# Altium schematic sheet WiirdFlex Top Alignment.SchDoc
size A
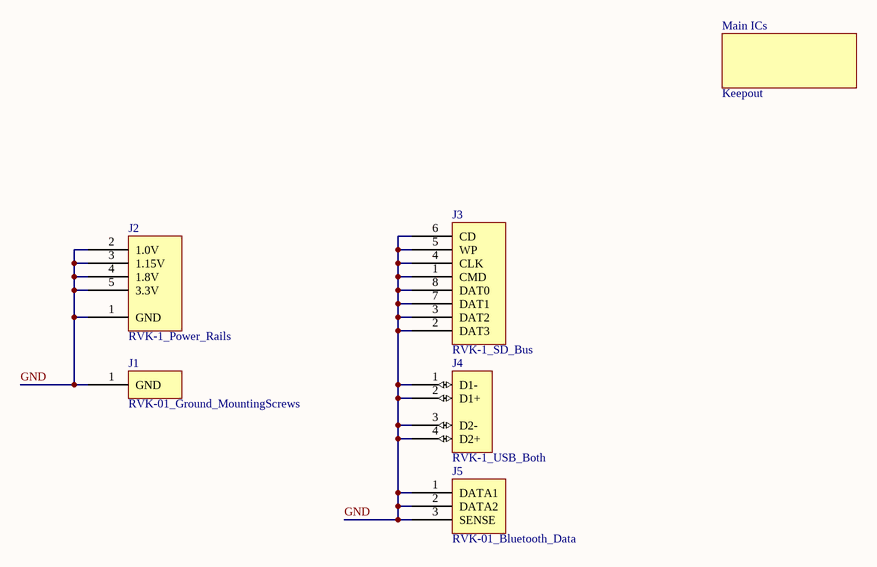
[diagram p0: WiirdFlex Top Alignment.SchDoc]

## Parts
J1  RVK-01_Ground_MountingScrews  [RVK-1_GND_Screws]
J2  RVK-1_Power_Rails  [RVK-1_Power_Rails_Top_Alignment]
J3  RVK-1_SD_Bus  [RVK-1_SD_Alignment]
J4  RVK-1_USB_Both  [RVK-1_USB_Top_Alignment]
J5  RVK-01_Bluetooth_Data  [RVK-1_BT_Data_Alignment]
Main_ICs  Keepout  [RVK-1_Main_IC_Keepout]

## Nets
GND: J1.1(GND) J2.1(GND) J2.2(1.0V) J2.3(1.15V) J2.4(1.8V) J2.5(3.3V) J3.1(CMD) J3.2(DAT3) J3.3(DAT2) J3.4(CLK) J3.5(WP) J3.6(CD) J3.7(DAT1) J3.8(DAT0) J4.1(D1-) J4.2(D1+) J4.3(D2-) J4.4(D2+) J5.1(DATA1) J5.2(DATA2) J5.3(SENSE)

## Library data of the parts
J2 = RVK-1_Power_Rails: Connection points for Wii power rails
Main_ICs = Keepout: ClassName: Keepout